# EAGLE schematic SOTB_Feb22 (EAGLE 9.6.2)
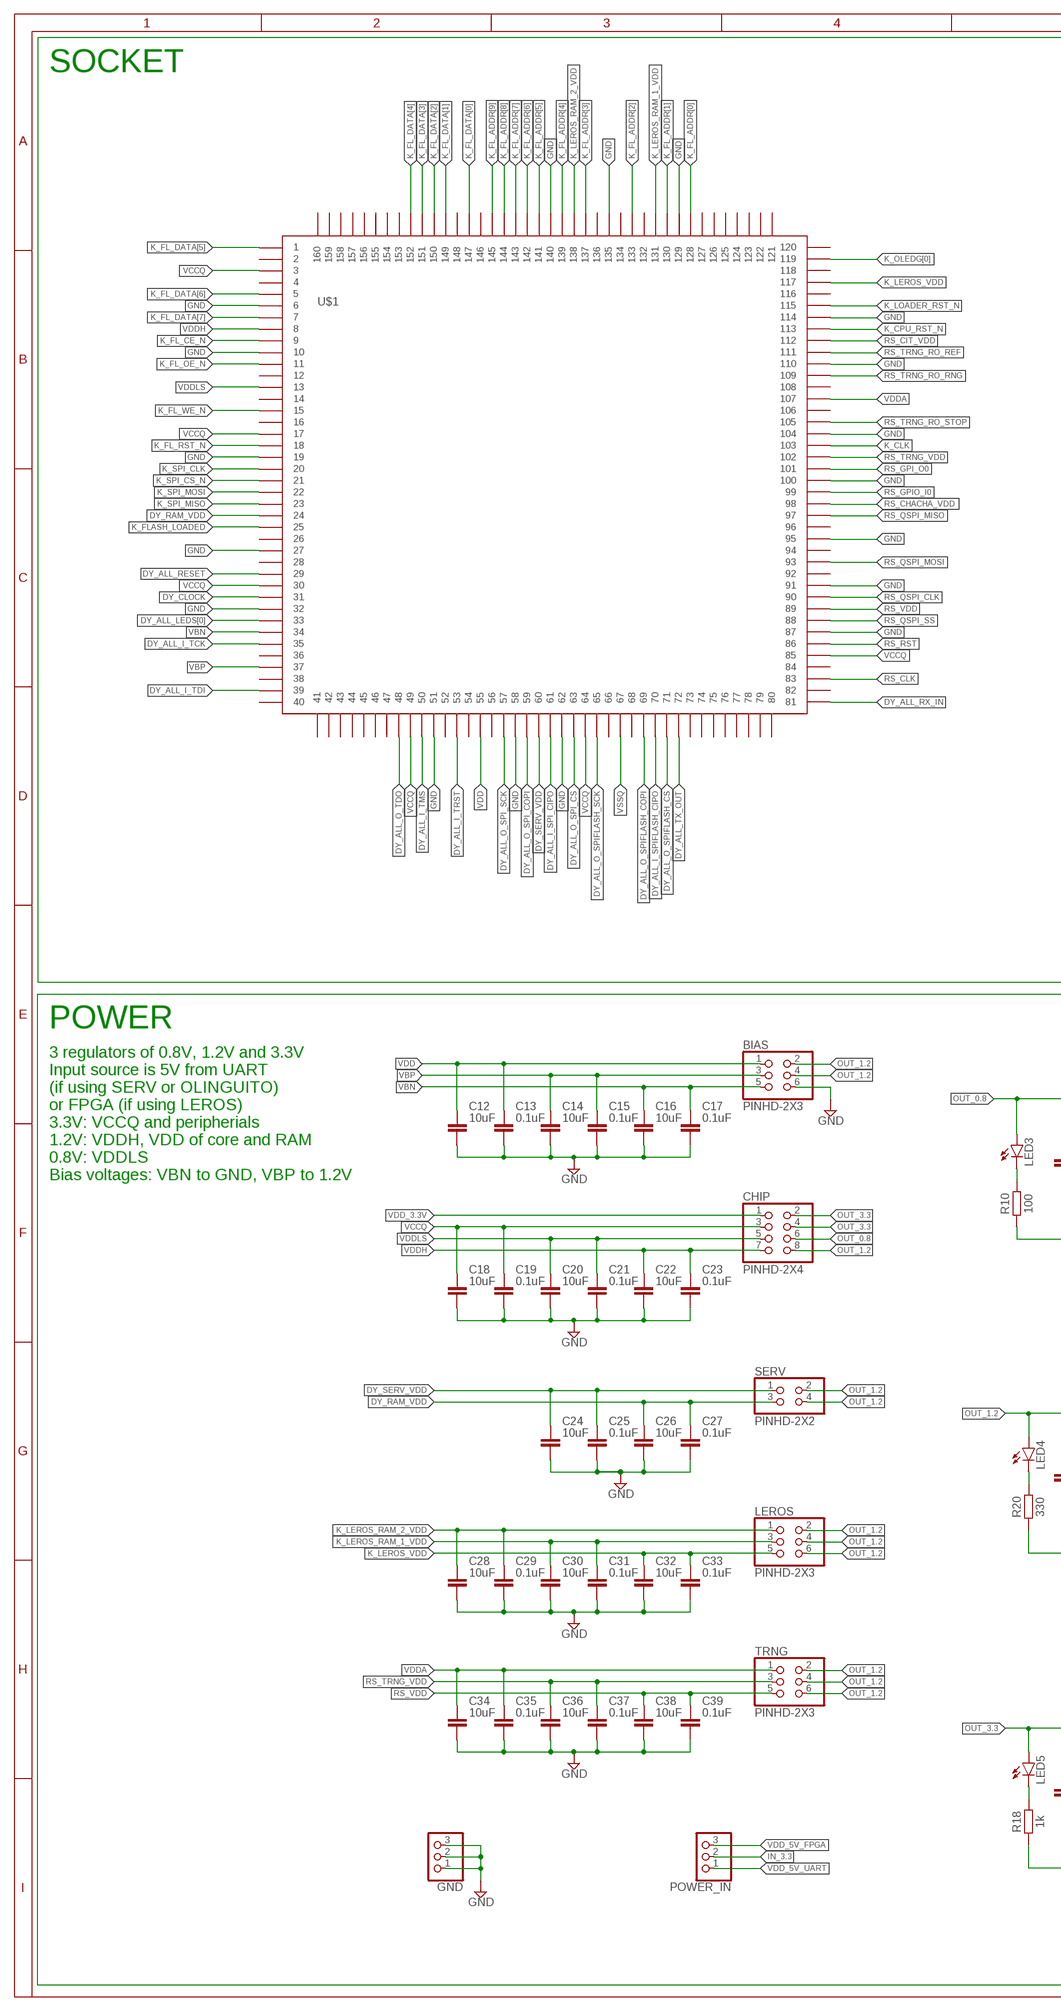
[diagram p0: schematic, sheet 1, part 1 of 2]
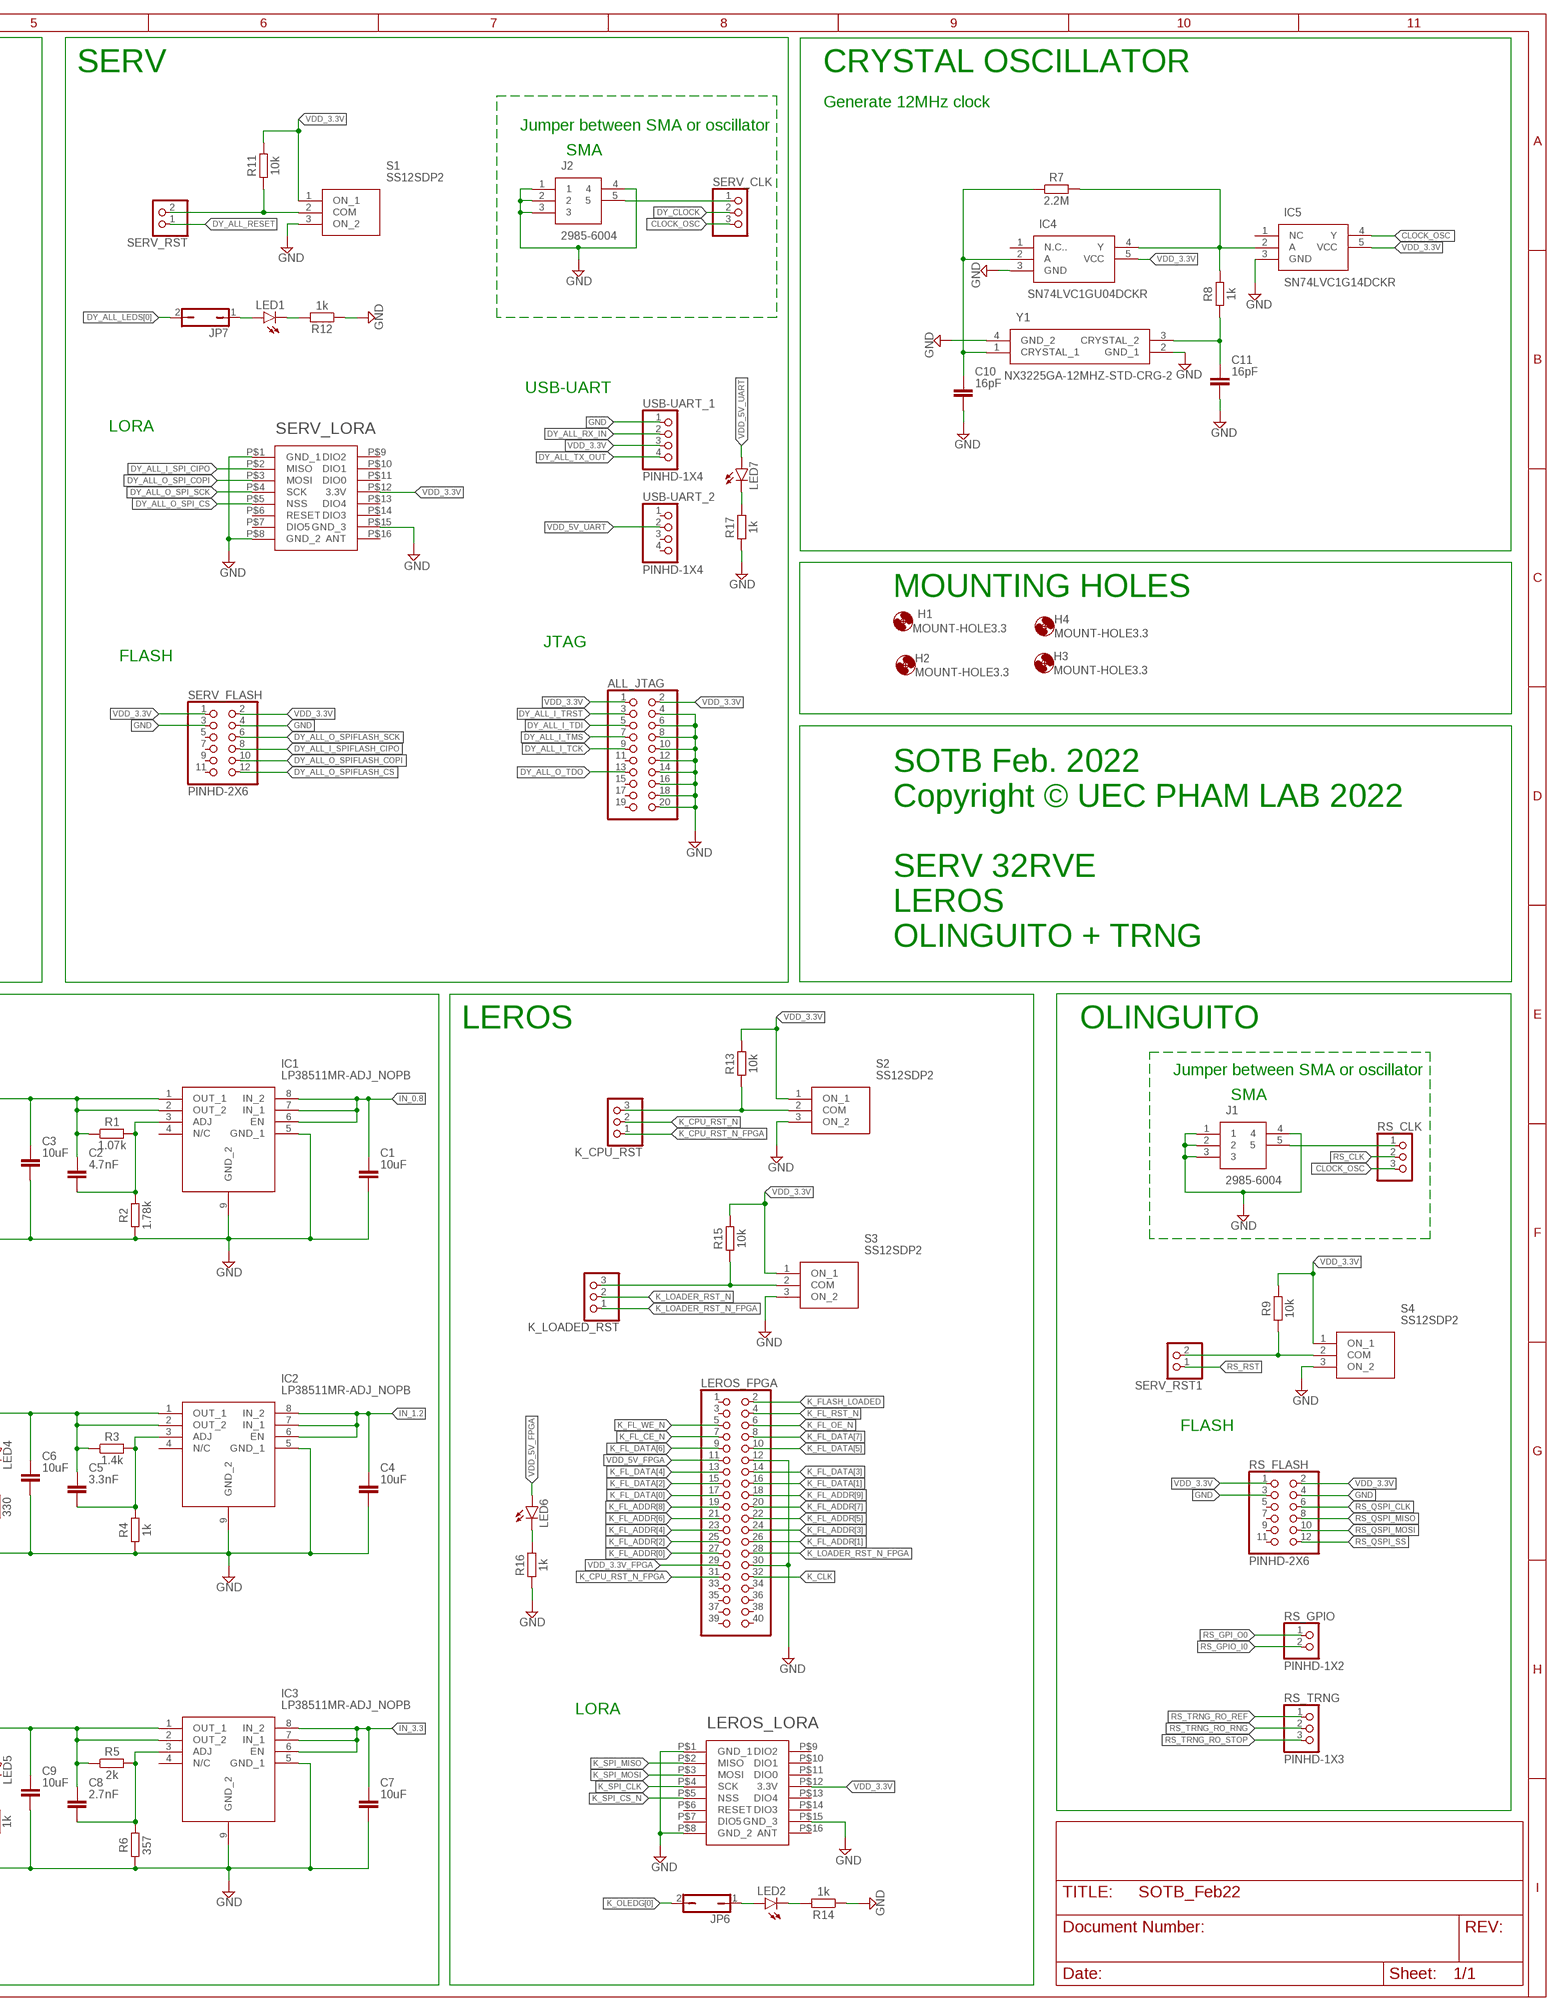
[diagram p1: schematic, sheet 1, part 2 of 2]

## Parts
ALL_JTAG  PINHD-2X10  [2X10]
BIAS  PINHD-2X3  [2X03]
C1  10uF  C_CHIP-1206(3216-METRIC)  [CAPC3216X135]
C2  4.7nF  C_CHIP-1206(3216-METRIC)  [CAPC3216X135]
C3  10uF  C_CHIP-1206(3216-METRIC)  [CAPC3216X135]
C4  10uF  C_CHIP-1206(3216-METRIC)  [CAPC3216X135]
C5  3.3nF  C_CHIP-1206(3216-METRIC)  [CAPC3216X135]
C6  10uF  C_CHIP-1206(3216-METRIC)  [CAPC3216X135]
C7  10uF  C_CHIP-1206(3216-METRIC)  [CAPC3216X135]
C8  2.7nF  C_CHIP-1206(3216-METRIC)  [CAPC3216X135]
C9  10uF  C_CHIP-1206(3216-METRIC)  [CAPC3216X135]
C10  16pF  C_CHIP-1206(3216-METRIC)  [CAPC3216X135]
C11  16pF  C_CHIP-1206(3216-METRIC)  [CAPC3216X135]
C12  10uF  C_CHIP-1206(3216-METRIC)  [CAPC3216X135]
C13  0.1uF  C_CHIP-1206(3216-METRIC)  [CAPC3216X135]
C14  10uF  C_CHIP-1206(3216-METRIC)  [CAPC3216X135]
C15  0.1uF  C_CHIP-1206(3216-METRIC)  [CAPC3216X135]
C16  10uF  C_CHIP-1206(3216-METRIC)  [CAPC3216X135]
C17  0.1uF  C_CHIP-1206(3216-METRIC)  [CAPC3216X135]
C18  10uF  C_CHIP-1206(3216-METRIC)  [CAPC3216X135]
C19  0.1uF  C_CHIP-1206(3216-METRIC)  [CAPC3216X135]
C20  10uF  C_CHIP-1206(3216-METRIC)  [CAPC3216X135]
C21  0.1uF  C_CHIP-1206(3216-METRIC)  [CAPC3216X135]
C22  10uF  C_CHIP-1206(3216-METRIC)  [CAPC3216X135]
C23  0.1uF  C_CHIP-1206(3216-METRIC)  [CAPC3216X135]
C24  10uF  C_CHIP-1206(3216-METRIC)  [CAPC3216X135]
C25  0.1uF  C_CHIP-1206(3216-METRIC)  [CAPC3216X135]
C26  10uF  C_CHIP-1206(3216-METRIC)  [CAPC3216X135]
C27  0.1uF  C_CHIP-1206(3216-METRIC)  [CAPC3216X135]
C28  10uF  C_CHIP-1206(3216-METRIC)  [CAPC3216X135]
C29  0.1uF  C_CHIP-1206(3216-METRIC)  [CAPC3216X135]
C30  10uF  C_CHIP-1206(3216-METRIC)  [CAPC3216X135]
C31  0.1uF  C_CHIP-1206(3216-METRIC)  [CAPC3216X135]
C32  10uF  C_CHIP-1206(3216-METRIC)  [CAPC3216X135]
C33  0.1uF  C_CHIP-1206(3216-METRIC)  [CAPC3216X135]
C34  10uF  C_CHIP-1206(3216-METRIC)  [CAPC3216X135]
C35  0.1uF  C_CHIP-1206(3216-METRIC)  [CAPC3216X135]
C36  10uF  C_CHIP-1206(3216-METRIC)  [CAPC3216X135]
C37  0.1uF  C_CHIP-1206(3216-METRIC)  [CAPC3216X135]
C38  10uF  C_CHIP-1206(3216-METRIC)  [CAPC3216X135]
C39  0.1uF  C_CHIP-1206(3216-METRIC)  [CAPC3216X135]
CHIP  PINHD-2X4  [2X04]
GND  PINHD-1X3  [1X03]
H1  MOUNT-HOLE3.3  [3,3]
H2  MOUNT-HOLE3.3  [3,3]
H3  MOUNT-HOLE3.3  [3,3]
H4  MOUNT-HOLE3.3  [3,3]
IC1  LP38511MR-ADJ_NOPB  [SOIC127P600X170-9N]
IC2  LP38511MR-ADJ_NOPB  [SOIC127P600X170-9N]
IC3  LP38511MR-ADJ_NOPB  [SOIC127P600X170-9N]
IC4  SN74LVC1GU04DCKR  [SOT65P210X110-5N]
IC5  SN74LVC1G14DCKR  [SOT65P210X110-5N]
J1  2985-6004  [29856004]
J2  2985-6004  [29856004]
JP6  JP1Q  [JP1]
JP7  JP1Q  [JP1]
K_CPU_RST  PINHD-1X3  [1X03]
K_LOADED_RST  PINHD-1X3  [1X03]
LED1  LEDCHIPLED_1206  [CHIPLED_1206]
LED2  LEDCHIPLED_1206  [CHIPLED_1206]
LED3  LEDCHIPLED_1206  [CHIPLED_1206]
LED4  LEDCHIPLED_1206  [CHIPLED_1206]
LED5  LEDCHIPLED_1206  [CHIPLED_1206]
LED6  LEDCHIPLED_1206  [CHIPLED_1206]
LED7  LEDCHIPLED_1206  [CHIPLED_1206]
LEROS  PINHD-2X3  [2X03]
LEROS_FPGA  PINHD-2X20  [2X20]
LEROS_LORA  RFM95W-915S2  [RFM95W-915S2]
POWER_IN  PINHD-1X3  [1X03]
R1  1.07k  R_CHIP-1206(3216-METRIC)  [RESC3216X70]
R2  1.78k  R_CHIP-1206(3216-METRIC)  [RESC3216X70]
R3  1.4k  R_CHIP-1206(3216-METRIC)  [RESC3216X70]
R4  1k  R_CHIP-1206(3216-METRIC)  [RESC3216X70]
R5  2k  R_CHIP-1206(3216-METRIC)  [RESC3216X70]
R6  357  R_CHIP-1206(3216-METRIC)  [RESC3216X70]
R7  2.2M  R_CHIP-1206(3216-METRIC)  [RESC3216X70]
R8  1k  R_CHIP-1206(3216-METRIC)  [RESC3216X70]
R9  10k  R_CHIP-1206(3216-METRIC)  [RESC3216X70]
R10  100  R_CHIP-1206(3216-METRIC)  [RESC3216X70]
R11  10k  R_CHIP-1206(3216-METRIC)  [RESC3216X70]
R12  1k  R_CHIP-1206(3216-METRIC)  [RESC3216X70]
R13  10k  R_CHIP-1206(3216-METRIC)  [RESC3216X70]
R14  1k  R_CHIP-1206(3216-METRIC)  [RESC3216X70]
R15  10k  R_CHIP-1206(3216-METRIC)  [RESC3216X70]
R16  1k  R_CHIP-1206(3216-METRIC)  [RESC3216X70]
R17  1k  R_CHIP-1206(3216-METRIC)  [RESC3216X70]
R18  1k  R_CHIP-1206(3216-METRIC)  [RESC3216X70]
R20  330  R_CHIP-1206(3216-METRIC)  [RESC3216X70]
RS_CLK  PINHD-1X3  [1X03]
RS_FLASH  PINHD-2X6  [2X06]
RS_GPIO  PINHD-1X2  [1X02]
RS_TRNG  PINHD-1X3  [1X03]
S1  SS12SDP2  [SS12SDP2]
S2  SS12SDP2  [SS12SDP2]
S3  SS12SDP2  [SS12SDP2]
S4  SS12SDP2  [SS12SDP2]
SERV  PINHD-2X2  [2X02]
SERV_CLK  PINHD-1X3  [1X03]
SERV_FLASH  PINHD-2X6  [2X06]
SERV_LORA  RFM95W-915S2  [RFM95W-915S2]
SERV_RST  PINHD-1X2  [1X02]
SERV_RST1  PINHD-1X2  [1X02]
TRNG  PINHD-2X3  [2X03]
U$1  QFP28-160PIN  [QFP28-160PIN]
USB-UART_1  PINHD-1X4  [1X04]
USB-UART_2  PINHD-1X4  [1X04]
Y1  NX3225GA-12MHZ-STD-CRG-2  [NX3225GA12MHZSTDCRG2]

## Nets
CLOCK_OSC: IC5.4(Y) RS_CLK.3 SERV_CLK.3
DY_ALL_I_SPI_CIPO: SERV_LORA.P$2(MISO) U$1.P$61
DY_ALL_I_SPIFLASH_CIPO: SERV_FLASH.8 U$1.P$70
DY_ALL_I_TCK: ALL_JTAG.9 U$1.P$35
DY_ALL_I_TDI: ALL_JTAG.5 U$1.P$39
DY_ALL_I_TMS: ALL_JTAG.7 U$1.P$50
DY_ALL_I_TRST: ALL_JTAG.3 U$1.P$53
DY_ALL_LEDS[0]: JP7.2 U$1.P$33
DY_ALL_O_SPI_COPI: SERV_LORA.P$3(MOSI) U$1.P$59
DY_ALL_O_SPI_CS: SERV_LORA.P$5(NSS) U$1.P$63
DY_ALL_O_SPI_SCK: SERV_LORA.P$4(SCK) U$1.P$57
DY_ALL_O_SPIFLASH_COPI: SERV_FLASH.10 U$1.P$69
DY_ALL_O_SPIFLASH_CS: SERV_FLASH.12 U$1.P$71
DY_ALL_O_SPIFLASH_SCK: SERV_FLASH.6 U$1.P$65
DY_ALL_O_TDO: ALL_JTAG.13 U$1.P$48
DY_ALL_RESET: SERV_RST.1 U$1.P$29
DY_ALL_RX_IN: U$1.P$81 USB-UART_1.2
DY_ALL_TX_OUT: U$1.P$72 USB-UART_1.4
DY_CLOCK: SERV_CLK.2 U$1.P$31
DY_RAM_VDD: C26.1 C27.1 SERV.3 U$1.P$24
DY_SERV_VDD: C24.1 C25.1 SERV.1 U$1.P$60
GND: ALL_JTAG.4 ALL_JTAG.6 ALL_JTAG.8 ALL_JTAG.10 ALL_JTAG.12 ALL_JTAG.14 ALL_JTAG.16 ALL_JTAG.18 ALL_JTAG.20 BIAS.6 C1.2 C3.2 C4.2 C6.2 C7.2 C9.2 C10.2 C11.2 C12.2 C13.2 C14.2 C15.2 C16.2 C17.2 C18.2 C19.2 C20.2 C21.2 C22.2 C23.2 C24.2 C25.2 C26.2 C27.2 C28.2 C29.2 C30.2 C31.2 C32.2 C33.2 C34.2 C35.2 C36.2 C37.2 C38.2 C39.2 GND.1 GND.2 GND.3 IC1.5(GND_1) IC1.9(GND_2) IC2.5(GND_1) IC2.9(GND_2) IC3.5(GND_1) IC3.9(GND_2) IC4.3(GND) IC5.3(GND) J1.1 J1.2 J1.3 J1.4 J2.1 J2.2 J2.3 J2.4 LEROS_FPGA.12 LEROS_FPGA.30 LEROS_LORA.P$1(GND_1) LEROS_LORA.P$8(GND_2) LEROS_LORA.P$15(GND_3) R2.1 R4.1 R6.1 R10.1 R12.1 R14.1 R16.1 R17.1 R18.1 R20.1 RS_FLASH.3 RS_FLASH.4 S1.3(ON_2) S2.3(ON_2) S3.3(ON_2) S4.3(ON_2) SERV_FLASH.3 SERV_FLASH.4 SERV_LORA.P$1(GND_1) SERV_LORA.P$8(GND_2) SERV_LORA.P$15(GND_3) U$1.P$6 U$1.P$10 U$1.P$19 U$1.P$27 U$1.P$32 U$1.P$51 U$1.P$58 U$1.P$62 U$1.P$87 U$1.P$91 U$1.P$95 U$1.P$100 U$1.P$104 U$1.P$110 U$1.P$114 U$1.P$129 U$1.P$135 U$1.P$140 USB-UART_1.1 Y1.2(GND_1) Y1.4(GND_2)
IN_0.8: C1.1 IC1.6(EN) IC1.7(IN_1) IC1.8(IN_2)
IN_1.2: C4.1 IC2.6(EN) IC2.7(IN_1) IC2.8(IN_2)
IN_3.3: C7.1 IC3.6(EN) IC3.7(IN_1) IC3.8(IN_2) POWER_IN.2
K_CLK: LEROS_FPGA.32 U$1.P$103
K_CPU_RST_N: K_CPU_RST.2 U$1.P$113
K_CPU_RST_N_FPGA: K_CPU_RST.1 LEROS_FPGA.31
K_FL_ADDR[0]: LEROS_FPGA.27 U$1.P$128
K_FL_ADDR[1]: LEROS_FPGA.26 U$1.P$130
K_FL_ADDR[2]: LEROS_FPGA.25 U$1.P$133
K_FL_ADDR[3]: LEROS_FPGA.24 U$1.P$137
K_FL_ADDR[4]: LEROS_FPGA.23 U$1.P$139
K_FL_ADDR[5]: LEROS_FPGA.22 U$1.P$141
K_FL_ADDR[6]: LEROS_FPGA.21 U$1.P$142
K_FL_ADDR[7]: LEROS_FPGA.20 U$1.P$143
K_FL_ADDR[8]: LEROS_FPGA.19 U$1.P$144
K_FL_ADDR[9]: LEROS_FPGA.18 U$1.P$145
K_FL_CE_N: LEROS_FPGA.7 U$1.P$9
K_FL_DATA[0]: LEROS_FPGA.17 U$1.P$147
K_FL_DATA[1]: LEROS_FPGA.16 U$1.P$149
K_FL_DATA[2]: LEROS_FPGA.15 U$1.P$150
K_FL_DATA[3]: LEROS_FPGA.14 U$1.P$151
K_FL_DATA[4]: LEROS_FPGA.13 U$1.P$152
K_FL_DATA[5]: LEROS_FPGA.10 U$1.P$1
K_FL_DATA[6]: LEROS_FPGA.9 U$1.P$5
K_FL_DATA[7]: LEROS_FPGA.8 U$1.P$7
K_FL_OE_N: LEROS_FPGA.6 U$1.P$11
K_FL_RST_N: LEROS_FPGA.4 U$1.P$18
K_FL_WE_N: LEROS_FPGA.5 U$1.P$15
K_FLASH_LOADED: LEROS_FPGA.2 U$1.P$25
K_LEROS_RAM_1_VDD: C30.1 C31.1 LEROS.3 U$1.P$131
K_LEROS_RAM_2_VDD: C28.1 C29.1 LEROS.1 U$1.P$138
K_LEROS_VDD: C32.1 C33.1 LEROS.5 U$1.P$117
K_LOADER_RST_N: K_LOADED_RST.2 U$1.P$115
K_LOADER_RST_N_FPGA: K_LOADED_RST.1 LEROS_FPGA.28
K_OLEDG[0]: JP6.2 U$1.P$119
K_SPI_CLK: LEROS_LORA.P$4(SCK) U$1.P$20
K_SPI_CS_N: LEROS_LORA.P$5(NSS) U$1.P$21
K_SPI_MISO: LEROS_LORA.P$2(MISO) U$1.P$23
K_SPI_MOSI: LEROS_LORA.P$3(MOSI) U$1.P$22
N$1: C2.2 IC1.3(ADJ) R1.2 R2.2
N$2: C5.2 IC2.3(ADJ) R3.2 R4.2
N$3: C8.2 IC3.3(ADJ) R5.2 R6.2
N$4: C10.1 IC4.2(A) R7.1 Y1.1(CRYSTAL_1)
N$5: IC4.4(Y) IC5.2(A) R7.2 R8.2
N$6: LED2.C R14.2
N$7: LED1.C R12.2
N$8: C11.1 R8.1 Y1.3(CRYSTAL_2)
N$9: LED3.C R10.2
N$10: LED4.C R20.2
N$11: LED5.C R18.2
N$12: JP6.1 LED2.A
N$13: JP7.1 LED1.A
N$15: LED6.C R16.2
N$16: LED7.C R17.2
OUT_0.8: C2.1 C3.1 CHIP.6 IC1.1(OUT_1) IC1.2(OUT_2) LED3.A R1.1
OUT_1.2: BIAS.2 BIAS.4 C5.1 C6.1 CHIP.8 IC2.1(OUT_1) IC2.2(OUT_2) LED4.A LEROS.2 LEROS.4 LEROS.6 R3.1 SERV.2 SERV.4 TRNG.2 TRNG.4 TRNG.6
OUT_3.3: C8.1 C9.1 CHIP.2 CHIP.4 IC3.1(OUT_1) IC3.2(OUT_2) LED5.A R5.1
RS_CHACHA_VDD: U$1.P$98
RS_CIT_VDD: U$1.P$112
RS_CLK: RS_CLK.2 U$1.P$83
RS_GPI_O0: RS_GPIO.1 U$1.P$101
RS_GPIO_I0: RS_GPIO.2 U$1.P$99
RS_QSPI_CLK: RS_FLASH.6 U$1.P$90
RS_QSPI_MISO: RS_FLASH.8 U$1.P$97
RS_QSPI_MOSI: RS_FLASH.10 U$1.P$93
RS_QSPI_SS: RS_FLASH.12 U$1.P$88
RS_RST: SERV_RST1.1 U$1.P$86
RS_TRNG_RO_REF: RS_TRNG.1 U$1.P$111
RS_TRNG_RO_RNG: RS_TRNG.2 U$1.P$109
RS_TRNG_RO_STOP: RS_TRNG.3 U$1.P$105
RS_TRNG_VDD: C36.1 C37.1 TRNG.3 U$1.P$102
RS_VDD: C38.1 C39.1 TRNG.5 U$1.P$89
RST_SW: R11.1 S1.2(COM) SERV_RST.2
RST_SW1: K_CPU_RST.3 R13.1 S2.2(COM)
RST_SW2: K_LOADED_RST.3 R15.1 S3.2(COM)
RST_SW3: R9.1 S4.2(COM) SERV_RST1.2
SMA_CLK: J2.5 SERV_CLK.1
SMA_CLK1: J1.5 RS_CLK.1
VBN: BIAS.5 C16.1 C17.1 U$1.P$34
VBP: BIAS.3 C14.1 C15.1 U$1.P$37
VCCQ: C18.1 C19.1 CHIP.3 U$1.P$3 U$1.P$17 U$1.P$30 U$1.P$49 U$1.P$64 U$1.P$85
VDD: BIAS.1 C12.1 C13.1 U$1.P$55
VDD_3.3V: ALL_JTAG.1 ALL_JTAG.2 CHIP.1 IC4.5(VCC) IC5.5(VCC) LEROS_LORA.P$12(3.3V) R9.2 R11.2 R13.2 R15.2 RS_FLASH.1 RS_FLASH.2 S1.1(ON_1) S2.1(ON_1) S3.1(ON_1) S4.1(ON_1) SERV_FLASH.1 SERV_FLASH.2 SERV_LORA.P$12(3.3V) USB-UART_1.3
VDD_3.3V_FPGA: LEROS_FPGA.29
VDD_5V_FPGA: LED6.A LEROS_FPGA.11 POWER_IN.3
VDD_5V_UART: LED7.A POWER_IN.1 USB-UART_2.2
VDDA: C34.1 C35.1 TRNG.1 U$1.P$107
VDDH: C22.1 C23.1 CHIP.7 U$1.P$8
VDDLS: C20.1 C21.1 CHIP.5 U$1.P$13
VSSQ: U$1.P$67
Unconnected: ALL_JTAG.11 ALL_JTAG.15 ALL_JTAG.17 ALL_JTAG.19 IC1.4(N/C) IC2.4(N/C) IC3.4(N/C) IC4.1(N.C..) IC5.1(NC) LEROS_FPGA.1 LEROS_FPGA.3 LEROS_FPGA.33 LEROS_FPGA.34 LEROS_FPGA.35 LEROS_FPGA.36 LEROS_FPGA.37 LEROS_FPGA.38 LEROS_FPGA.39 LEROS_FPGA.40 LEROS_LORA.P$6(RESET) LEROS_LORA.P$7(DIO5) LEROS_LORA.P$9(DIO2) LEROS_LORA.P$10(DIO1) LEROS_LORA.P$11(DIO0) LEROS_LORA.P$13(DIO4) LEROS_LORA.P$14(DIO3) LEROS_LORA.P$16(ANT) RS_FLASH.5 RS_FLASH.7 RS_FLASH.9 RS_FLASH.11 SERV_FLASH.5 SERV_FLASH.7 SERV_FLASH.9 SERV_FLASH.11 SERV_LORA.P$6(RESET) SERV_LORA.P$7(DIO5) SERV_LORA.P$9(DIO2) SERV_LORA.P$10(DIO1) SERV_LORA.P$11(DIO0) SERV_LORA.P$13(DIO4) SERV_LORA.P$14(DIO3) SERV_LORA.P$16(ANT) U$1.P$2 U$1.P$4 U$1.P$12 U$1.P$14 U$1.P$16 U$1.P$26 U$1.P$28 U$1.P$36 U$1.P$38 U$1.P$40 U$1.P$41 U$1.P$42 U$1.P$43 U$1.P$44 U$1.P$45 U$1.P$46 U$1.P$47 U$1.P$52 U$1.P$54 U$1.P$56 U$1.P$66 U$1.P$68 U$1.P$73 U$1.P$74 U$1.P$75 U$1.P$76 U$1.P$77 U$1.P$78 U$1.P$79 U$1.P$80 U$1.P$82 U$1.P$84 U$1.P$92 U$1.P$94 U$1.P$96 U$1.P$106 U$1.P$108 U$1.P$116 U$1.P$118 U$1.P$120 U$1.P$121 U$1.P$122 U$1.P$123 U$1.P$124 U$1.P$125 U$1.P$126 U$1.P$127 U$1.P$132 U$1.P$134 U$1.P$136 U$1.P$146 U$1.P$148 U$1.P$153 U$1.P$154 U$1.P$155 U$1.P$156 U$1.P$157 U$1.P$158 U$1.P$159 U$1.P$160 USB-UART_2.1 USB-UART_2.3 USB-UART_2.4

## Notes on the sheet
- SOCKET | SERV | CRYSTAL OSCILLATOR
- Generate 12MHz clock
- Jumper between SMA or oscillator
- SMA
- USB-UART
- LORA
- MOUNTING HOLES
- JTAG
- FLASH
- SOTB Feb. 2022
  Copyright © UEC PHAM LAB 2022
  
  SERV 32RVE
  LEROS
  OLINGUITO + TRNG
- POWER | LEROS | OLINGUITO
- Jumper between SMA or oscillator
- SMA
- 3 regulators of 0.8V, 1.2V and 3.3V
  Input source is 5V from UART 
  (if using SERV or OLINGUITO)
  or FPGA (if using LEROS)
  3.3V: VCCQ and peripherials
  1.2V: VDDH, VDD of core and RAM
  0.8V: VDDLS
  Bias voltages: VBN to GND, VBP to 1.2V
- FLASH
- LORA

## Library data of the parts
ALL_JTAG = pinhead:PINHD-2X10: PIN HEADER
BIAS LEROS TRNG = Connector:PINHD-2X3: PIN HEADER; CATEGORY: CONNECTOR; SUB-CATEGORY: PIN-HEADER
C1-C39 = Capacitor:C: Capacitor - Generic; CATEGORY: Capacitor
CHIP = Connector:PINHD-2X4: PIN HEADER; CATEGORY: CONNECTOR; SUB-CATEGORY: PIN-HEADER
GND K_CPU_RST K_LOADED_RST POWER_IN RS_CLK SERV_CLK = pinhead:PINHD-1X3: PIN HEADER
H1-H4 = holes:MOUNT-HOLE: MOUNTING HOLE with drill center marker
IC1-IC3 = SamacSys_Parts:LP38511MR-ADJ_NOPB: Texas Instruments LP38511MR-ADJ/NOPB, LDO Voltage Regulator, Adjustable 0.8A, 0.5 3.3 V +/-2%, 8-Pin PSOP Source: Datasheet <http://www.ti.com/lit/gpn/lp38511-adj>; ARROW_PART_NUMBER: LP38511MR-ADJ/NOPB; ARROW_PRICE-STOCK: https://www.arrow.com/en/products/lp38511mr-adjnopb/texas-instruments; DESCRIPTION: Texas Instruments LP38511MR-ADJ/NOPB, LDO Voltage Regulator, Adjustable 0.8A, 0.5 3.3 V +/-2%, 8-Pin PSOP; HEIGHT: 1.7mm; MANUFACTURER_NAME: Texas Instruments; MANUFACTURER_PART_NUMBER: LP38511MR-ADJ/NOPB; MOUSER_PART_NUMBER: 926-38511MR-ADJ/NOPB; MOUSER_PRICE-STOCK: https://www.mouser.co.uk/ProductDetail/Texas-Instruments/LP38511MR-ADJ-NOPB?qs=1FNqv8aZn1Rpii1QpyVwqA%3D%3D
IC4 = SamacSys_Parts:SN74LVC1GU04DCKR: Single Inverter Gate Source: Datasheet <http://www.ti.com/lit/gpn/sn74lvc1gu04>; ARROW_PART_NUMBER: SN74LVC1GU04DCKR; ARROW_PRICE-STOCK: https://www.arrow.com/en/products/sn74lvc1gu04dckr/texas-instruments?region=nac; DESCRIPTION: Single Inverter Gate; HEIGHT: 1.1mm; MANUFACTURER_NAME: Texas Instruments; MANUFACTURER_PART_NUMBER: SN74LVC1GU04DCKR; MOUSER_PART_NUMBER: 595-SN74LVC1GU04DCKR; MOUSER_PRICE-STOCK: https://www.mouser.co.uk/ProductDetail/Texas-Instruments/SN74LVC1GU04DCKR?qs=HE9hdJajmeplLYeGBFwXAQ%3D%3D
IC5 = SamacSys_Parts:SN74LVC1G14DCKR: SN74LVC1G14 Single Schmitt-Trigger Inverter Source: Datasheet <http://www.ti.com/lit/ds/symlink/sn74lvc1g14.pdf>; ARROW_PART_NUMBER: SN74LVC1G14DCKR; ARROW_PRICE-STOCK: https://www.arrow.com/en/products/sn74lvc1g14dckr/texas-instruments?region=nac; DESCRIPTION: SN74LVC1G14 Single Schmitt-Trigger Inverter; HEIGHT: 1.1mm; MANUFACTURER_NAME: Texas Instruments; MANUFACTURER_PART_NUMBER: SN74LVC1G14DCKR; MOUSER_PART_NUMBER: 595-SN74LVC1G14DCKR; MOUSER_PRICE-STOCK: https://www.mouser.co.uk/ProductDetail/Texas-Instruments/SN74LVC1G14DCKR?qs=j%2FZo4ajzVJKuhrRdLjfZIw%3D%3D
J1 J2 = SamacSys_Parts:2985-6004: RF Connectors / Coaxial Connectors SMA F PCB Thru-Hole Conn, 50-OHMS 1000 Source: Datasheet <https://componentsearchengine.com//2985-6004.pdf>; DESCRIPTION: RF Connectors / Coaxial Connectors SMA F PCB Thru-Hole Conn, 50-OHMS 1000; HEIGHT: 9.54mm; MANUFACTURER_NAME: Amphenol; MANUFACTURER_PART_NUMBER: 2985-6004; MOUSER_PART_NUMBER: 523-2985-6004; MOUSER_PRICE-STOCK: https://www.mouser.co.uk/ProductDetail/Amphenol-SV-Microwave/2985-6004?qs=jyo2EwfRkUNkt8LGijRXFQ%3D%3D
JP6 JP7 = jumper:JP1Q: JUMPER
LED1-LED7 = led:LED: LED OSRAM: - CHIPLED LG R971, LG N971, LY N971, LG Q971, LY Q971, LO R971, LY R971 LH N974, LH R974 LS Q976, LO Q976, LY Q976 LO Q996 - Hyper CHIPLED LW Q18S LB Q993, LB Q99A, LB R99A - SideLED LS A670, LO A670, LY A670, LG A670, LP A670 LB A673, LV A673, LT A673, LW A673 LH A674 LY A675 LS A676, LA A676, LO A676, LY A676, LW A676 LS A679, LY A679, LG A679 - Hyper Micro SIDELED® LS Y876, LA Y876, LO Y876, LY Y876 LT Y87S - SmartLED LW L88C, LW L88S LB L89C, LB L89S, LG L890 LS L89K, LO L89K, LY L89K LS L896, LA L896, LO L896, LY L896 - TOPLED LS T670, LO T670, LY T670, LG T670, LP T670 LSG T670, LSP T670, LSY T670, LOP T670, LYG T670 LG T671, LOG T671, LSG T671 LB T673, LV T673, LT T673, LW T673 LH T674 LS T676, LA T676, LO T676, LY T676, LB T676, LH T676, LSB T676, LW T676 LB T67C, LV T67C, LT T67C, LS T67K, LO T67K, LY T67K, LW E67C LS E67B, LA E67B, LO E67B, LY E67B, LB E67C, LV E67C, LT E67C LW T67C LS T679, LY T679, LG T679 LS T770, LO T770, LY T770, LG T770, LP T770 LB T773, LV T773, LT T773, LW T773 LH T774 LS E675, LA E675, LY E675, LS T675 LS T776, LA T776, LO T776, LY T776, LB T776 LHGB T686 LT T68C, LB T68C - Hyper Mini TOPLED® LB M676 - Mini TOPLED Santana® LG M470 LS M47K, LO M47K, LY M47K Source: http://www.osram.convergy.de LUXEON: - LUMILED® LXK2-PW12-R00, LXK2-PW12-S00, LXK2-PW14-U00, LXK2-PW14-V00 LXK2-PM12-R00, LXK2-PM12-S00, LXK2-PM14-U00 LXK2-PE12-Q00, LXK2-PE12-R00, LXK2-PE12-S00, LXK2-PE14-T00, LXK2-PE14-U00 LXK2-PB12-K00, LXK2-PB12-L00, LXK2-PB12-M00, LXK2-PB14-N00, LXK2-PB14-P00, LXK2-PB14-Q00 LXK2-PR12-L00, LXK2-PR12-M00, LXK2-PR14-Q00, LXK2-PR14-R00 LXK2-PD12-Q00, LXK2-PD12-R00, LXK2-PD12-S00 LXK2-PH12-R00, LXK2-PH12-S00 LXK2-PL12-P00, LXK2-PL12-Q00, LXK2-PL12-R00 Source: www.luxeon.com KINGBRIGHT: KA-3528ASYC Source: www.kingbright.com
LEROS_FPGA = pinhead:PINHD-2X20: PIN HEADER
LEROS_LORA SERV_LORA = Duy:RFM95W-915S2
R1-R18 R20 = Resistor:R: Resistor Fixed - Generic; CATEGORY: Resistor; SUB-CATEGORY: Fixed
RS_FLASH SERV_FLASH = Connector:PINHD-2X6: PIN HEADER; CATEGORY: CONNECTOR; SUB-CATEGORY: PIN-HEADER
RS_GPIO = Connector:PINHD-1X2: PIN HEADER; CATEGORY: CONNECTOR; SUB-CATEGORY: PIN-HEADER
RS_TRNG = Connector:PINHD-1X3: PIN HEADER; CATEGORY: CONNECTOR; SUB-CATEGORY: PIN-HEADER
S1-S4 = SamacSys_Parts:SS12SDP2: Switch, Slide,Sub Miniature,Top Actuated,SPDT, On-none-On Source: Datasheet; DESCRIPTION: Switch, Slide,Sub Miniature,Top Actuated,SPDT, On-none-On; HEIGHT: 4mm; MANUFACTURER_NAME: NKK Switches; MANUFACTURER_PART_NUMBER: SS12SDP2; MOUSER_PART_NUMBER: 633-SS12SDP2; MOUSER_PRICE-STOCK: https://www.mouser.co.uk/ProductDetail/NKK-Switches/SS12SDP2?qs=Av7JdS0MGqKsG%252BWOKKtU2w%3D%3D
SERV = Connector:PINHD-2X2: PIN HEADER; CATEGORY: CONNECTOR; SUB-CATEGORY: PIN-HEADER
SERV_RST SERV_RST1 = pinhead:PINHD-1X2: PIN HEADER
U$1 = QFP28-160PIN_SAPPORO_ROBOTICS:QFP28-160PIN
USB-UART_1 USB-UART_2 = Connector:PINHD-1X4: PIN HEADER; CATEGORY: CONNECTOR; SUB-CATEGORY: PIN-HEADER
Y1 = SamacSys_Parts:NX3225GA-12MHZ-STD-CRG-2: NDK 12MHz Crystal Unit +/-20ppm SMD 4-Pin 3.2 x 2.5 x 0.75mm Source: Datasheet <https://datasheet.datasheetarchive.com/originals/distributors/Datasheets_SAMA/e448b11b6d77781431a8823f463adabd.pdf>; DESCRIPTION: NDK 12MHz Crystal Unit +/-20ppm SMD 4-Pin 3.2 x 2.5 x 0.75mm; HEIGHT: 0.9mm; MANUFACTURER_NAME: NDK; MANUFACTURER_PART_NUMBER: NX3225GA-12MHZ-STD-CRG-2; MOUSER_PART_NUMBER: 344-NX3225GA12STCRG2; MOUSER_PRICE-STOCK: https://www.mouser.co.uk/ProductDetail/NDK/NX3225GA-12MHZ-STD-CRG-2?qs=w%2Fv1CP2dgqoRB9b4zEbU%252BQ%3D%3D